# Altium schematic sheet CM0 Controller FreeScale.SchDoc
size A
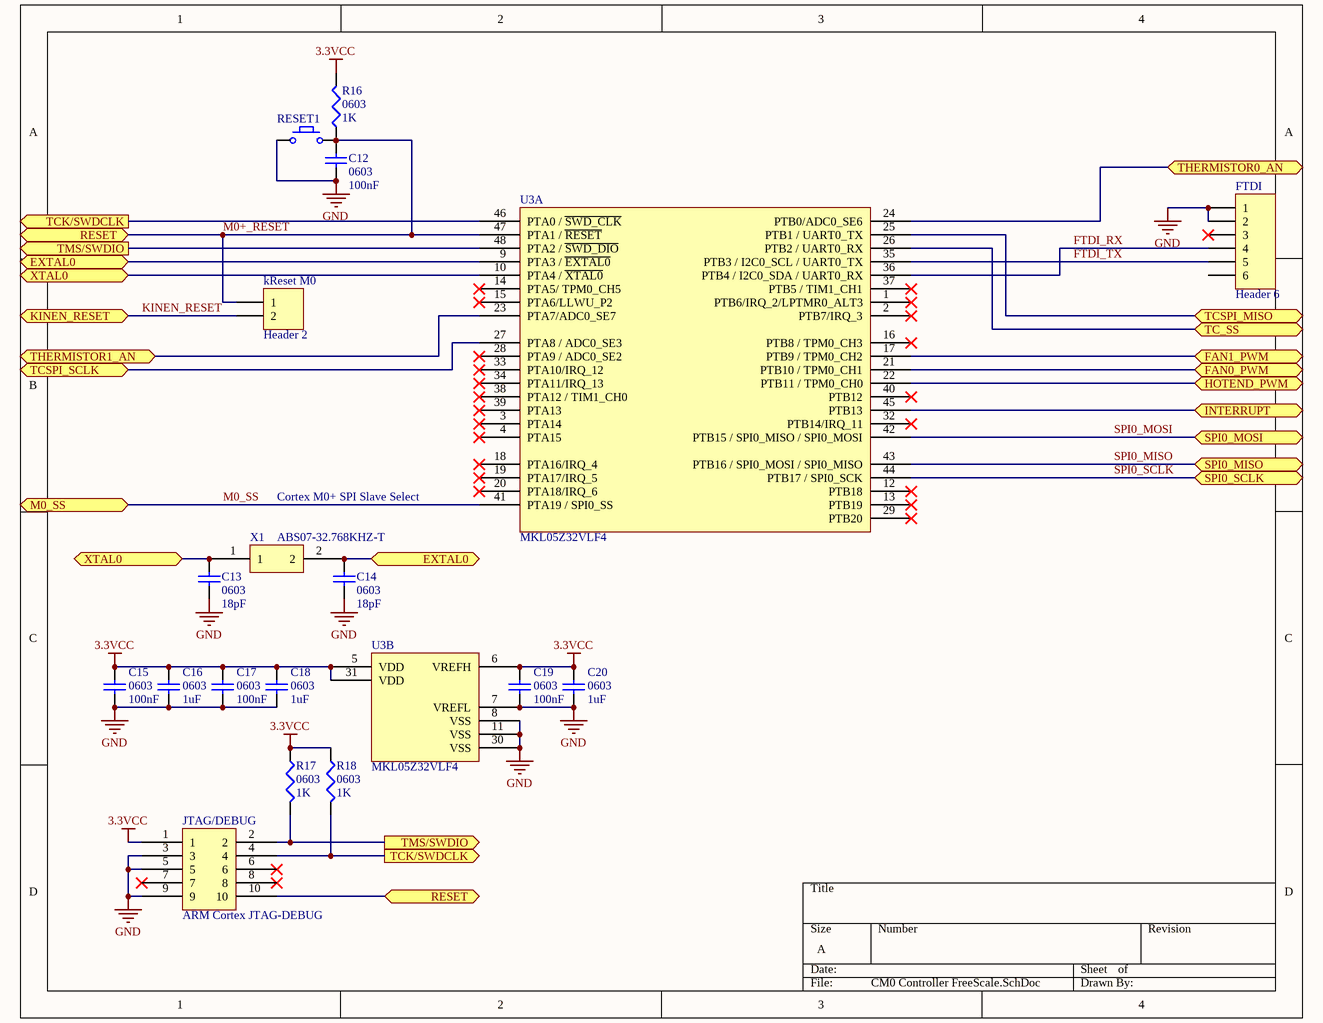
[diagram p0: CM0 Controller FreeScale.SchDoc]

## Parts
C12  0603  value 100nF  [1608[0603]]
C13  0603  value 18pF  [1608[0603]]
C14  0603  value 18pF  [1608[0603]]
C15  0603  value 100nF  [1608[0603]]
C16  0603  value 1uF  [1608[0603]]
C17  0603  value 100nF  [1608[0603]]
C18  0603  value 1uF  [1608[0603]]
C19  0603  value 100nF  [1608[0603]]
C20  0603  value 1uF  [1608[0603]]
FTDI  Header 6  [HDR1X6]
JTAG/DEBUG  ARM Cortex JTAG-DEBUG  [FTSH-105-XX-X-DV]
kReset_M0  Header 2  [HDR1X2]
R16  0603  value 1K  [J1-0603]
R17  0603  value 1K  [J1-0603]
R18  0603  value 1K  [J1-0603]
RESET1  Tactile Switch  [Mountain Switch TS6324T1607]  (value not drawn)
U3  MKL05Z32VLF4  [MKL05Z32VLF4]  (parts A,B of 2)
X1  ABS07-32.768KHZ-T  [ABS07-32.768KHZ-T]

## Ports
EXTAL0, FAN0_PWM, FAN1_PWM, HOTEND_PWM, INTERRUPT, KINEN_RESET, M0_SS, RESET (bidir), SPI0_MISO, SPI0_MOSI, SPI0_SCLK, TC_SS, TCK/SWDCLK (out), TCSPI_MISO, TCSPI_SCLK, THERMISTOR0_AN, THERMISTOR1_AN, TMS/SWDIO (out), XTAL0

## Nets
3.3VCC: C15.2 C16.2 C17.2 C18.2 C19.1 C20.1 JTAG/DEBUG.1 R16.2 R17.1 R18.1 U3.5(VDD) U3.6(VREFH) U3.31(VDD)
GND: C12.2 C13.2 C14.2 C15.1 C16.1 C17.1 C18.1 C19.2 C20.2 FTDI.1 FTDI.2 JTAG/DEBUG.3 JTAG/DEBUG.5 JTAG/DEBUG.9 RESET1.1 U3.7(VREFL) U3.8(VSS) U3.11(VSS) U3.30(VSS)
EXTAL0: C14.1 U3.9(PTA3_/_~{EXTAL0}) X1.2 ; port EXTAL0
FAN0_PWM: U3.21(PTB10_/_TPM0_CH1) ; port FAN0_PWM
FAN1_PWM: U3.17(PTB9_/_TPM0_CH2) ; port FAN1_PWM
FTDI_RX: FTDI.4 U3.36(PTB4_/_I2C0_SDA_/_UART0_RX)
FTDI_TX: FTDI.5 U3.35(PTB3_/_I2C0_SCL_/_UART0_TX)
HOTEND_PWM: U3.22(PTB11_/_TPM0_CH0) ; port HOTEND_PWM
INTERRUPT: U3.45(PTB13) ; port INTERRUPT
KINEN_RESET: kReset_M0.2 ; port KINEN_RESET
M0+_RESET: C12.1 JTAG/DEBUG.10 kReset_M0.1 R16.1 RESET1.2 U3.47(PTA1_/_~{RESET}) ; port RESET
M0_SS: U3.41(PTA19_/_SPI0_SS) ; port M0_SS
SPI0_MISO: U3.43(PTB16_/_SPI0_MOSI_/_SPI0_MISO) ; port SPI0_MISO
SPI0_MOSI: U3.42(PTB15_/_SPI0_MISO_/_SPI0_MOSI) ; port SPI0_MOSI
SPI0_SCLK: U3.44(PTB17_/_SPI0_SCK) ; port SPI0_SCLK
TC_SS: U3.26(PTB2_/_UART0_RX) ; port TC_SS
TCK/SWDCLK: JTAG/DEBUG.4 R18.2 U3.46(PTA0_/_~{SWD_CLK}) ; port TCK/SWDCLK
TCSPI_MISO: U3.25(PTB1_/_UART0_TX) ; port TCSPI_MISO
TCSPI_SCLK: U3.27(PTA8_/_ADC0_SE3) ; port TCSPI_SCLK
THERMISTOR0_AN: U3.24(PTB0/ADC0_SE6) ; port THERMISTOR0_AN
THERMISTOR1_AN: U3.23(PTA7/ADC0_SE7) ; port THERMISTOR1_AN
TMS/SWDIO: JTAG/DEBUG.2 R17.2 U3.48(PTA2_/_~{SWD_DIO}) ; port TMS/SWDIO
XTAL0: C13.1 U3.10(PTA4_/_~{XTAL0}) X1.1 ; port XTAL0

Not connected (* = marked no-connect by the designer): FTDI 3* 6; JTAG/DEBUG 6* 7* 8*; U3 1(PTB6/IRQ_2/LPTMR0_ALT3)* 2(PTB7/IRQ_3)* 3(PTA14)* 4(PTA15)* 12(PTB18)* 13(PTB19)* 14(PTA5/_TPM0_CH5)* 15(PTA6/LLWU_P2)* 16(PTB8_/_TPM0_CH3)* 18(PTA16/IRQ_4)* 19(PTA17/IRQ_5)* 20(PTA18/IRQ_6)* 28(PTA9_/_ADC0_SE2)* 29(PTB20)* 32(PTB14/IRQ_11)* 33(PTA10/IRQ_12)* 34(PTA11/IRQ_13)* 37(PTB5_/_TIM1_CH1)* 38(PTA12_/_TIM1_CH0)* 39(PTA13)* 40(PTB12)*

## Notes on the sheet
- Cortex M0+ SPI Slave Select

## Library data of the parts
C12-C20 = Cap Semi: Capacitor (Semiconductor SIM Model); Published: 8-Jun-2000; LatestRevisionDate: 29-May-2009; LatestRevisionNote: IPC-7351 Footprint Added.; PackageReference: C1206; Publisher: Altium Limited; PackageDescription: Chip Capacitor
FTDI = Header 6: Header, 6-Pin; LatestRevisionDate: 17-Jul-2002; LatestRevisionNote: Re-released for DXP Platform.; Publisher: Altium Limited
JTAG/DEBUG = ARM Cortex JTAG-DEBUG Header
kReset_M0 = Header 2: Header, 2-Pin; LatestRevisionDate: 17-Jul-2002; LatestRevisionNote: Re-released for DXP Platform.; Publisher: Altium Limited
R16-R18 = Res3: Resistor; Published: 8-Jun-2000; LatestRevisionDate: 29-May-2009; LatestRevisionNote: IPC-7351 Footprint Added.; PackageReference: J1-0603; Publisher: Altium Limited; PackageDescription: Chip Resistor
U3 = MKL05Z32VLF4: ARM Cortex M0+
X1 = ABS07-32.768KHZ-T: ABS07-32.768KHZ-T RTC Crystal Oscillator